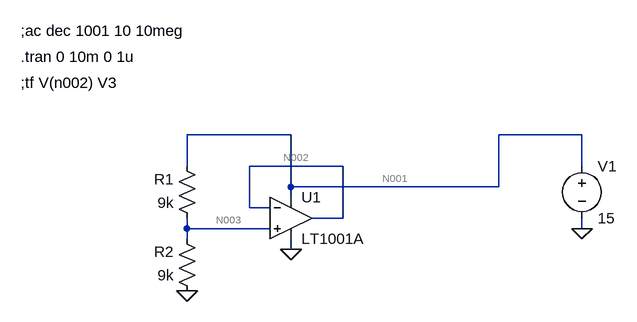
[diagram p0: schematic VirtualGround.asc]
VirtualGround.asc, the LTspice schematic file:
Version 4
SHEET 1 880 680
WIRE 320 -16 160 -16
WIRE 768 -16 640 -16
WIRE 160 32 160 -16
WIRE 400 32 256 32
WIRE 768 32 768 -16
WIRE 320 64 320 -16
WIRE 640 64 640 -16
WIRE 640 64 320 64
WIRE 320 80 320 64
WIRE 256 96 256 32
WIRE 288 96 256 96
WIRE 400 112 400 32
WIRE 400 112 352 112
WIRE 160 128 160 112
WIRE 288 128 160 128
WIRE 768 128 768 112
WIRE 160 144 160 128
WIRE 320 160 320 144
FLAG 768 128 0
FLAG 160 224 0
FLAG 320 160 0
SYMBOL res 176 128 R180
WINDOW 0 36 76 Left 2
WINDOW 3 36 40 Left 2
SYMATTR InstName R1
SYMATTR Value 9k
SYMBOL res 176 240 R180
WINDOW 0 36 76 Left 2
WINDOW 3 36 40 Left 2
SYMATTR InstName R2
SYMATTR Value 9k
SYMBOL voltage 768 16 R0
WINDOW 123 0 0 Left 2
WINDOW 39 0 0 Left 2
SYMATTR InstName V1
SYMATTR Value 15
SYMBOL Opamps\\LT1001A 320 48 R0
SYMATTR InstName U1
TEXT -96 -136 Left 2 !.tran 0 10m 0 1u
TEXT -96 -96 Left 2 !;tf V(n002) V3
TEXT -96 -176 Left 2 !;ac dec 1001 10 10meg

The netlist it stands for:
* VirtualGround.asc
R1 N003 N001 9k
R2 0 N003 9k
V1 N001 0 15
XU1 N003 N002 N001 0 N002 LT1001  ; LT1001A, pins In+ In- V+ V- OUT
.tran 0 10m 0 1u
;tf V(n002) V3
;ac dec 1001 10 10meg
.lib LTC.lib
.backanno
.end

* Results of the author's LTspice run, read from the files saved beside the schematic
* Operating Point, zero values left out:
*   V(n003) = 7.5 V
*   V(n001) = 15 V
*   V(n002) = 7.5 V
*   I(R2) = -833.3 µA
*   I(R1) = -833.3 µA
*   I(V1) = -3.083 mA
*   Ix(u1:3) = 2.25 mA
*   Ix(u1:4) = -2.25 mA